# Altium schematic sheet PCI short card universal - 32 BIT-6.schdoc
size A3
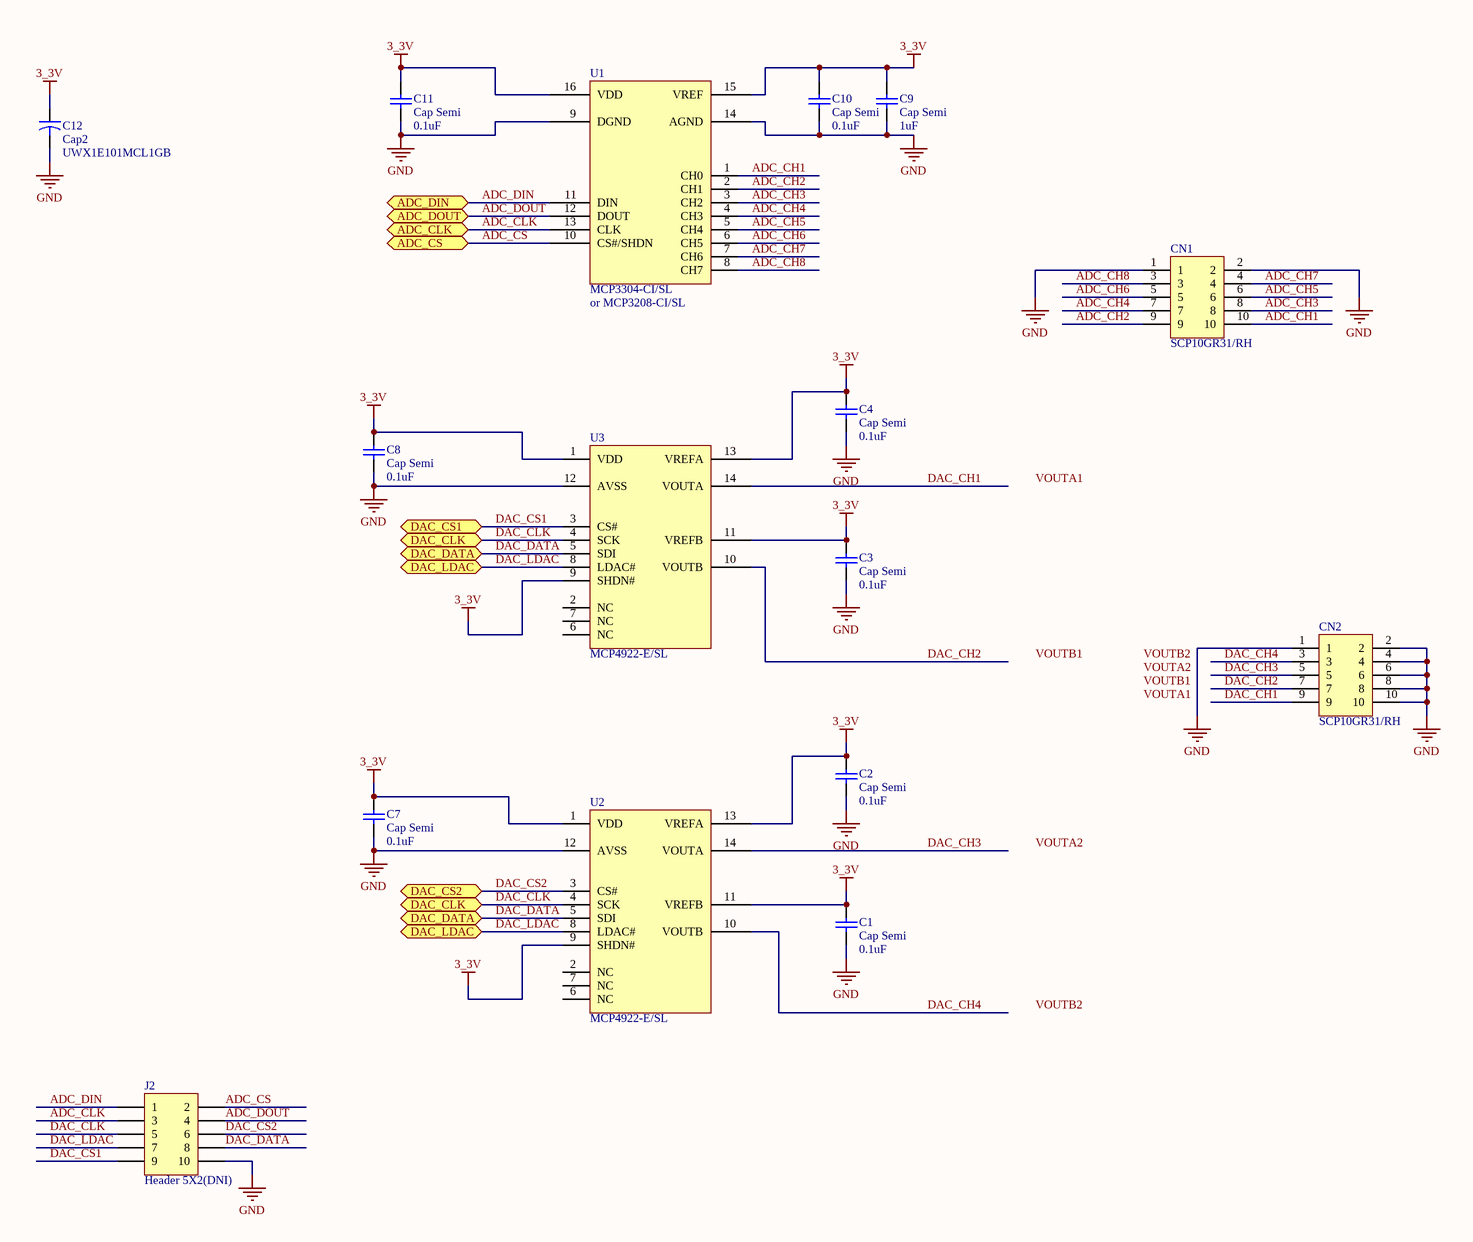
[diagram p0: PCI short card universal - 32 BIT-6.schdoc]

## Parts
C1  Cap Semi  value 0.1uF  [RESC1608N]
C2  Cap Semi  value 0.1uF  [RESC1608N]
C3  Cap Semi  value 0.1uF  [RESC1608N]
C4  Cap Semi  value 0.1uF  [RESC1608N]
C7  Cap Semi  value 0.1uF  [RESC1608N]
C8  Cap Semi  value 0.1uF  [RESC1608N]
C9  Cap Semi  value 1uF  [RESC1608N]
C10  Cap Semi  value 0.1uF  [RESC1608N]
C11  Cap Semi  value 0.1uF  [RESC1608N]
C12  Cap2  value UWX1E101MCL1GB  [ECEL_D8]
CN1  SCP10GR31/RH  [SCP10GR31/RH]
CN2  SCP10GR31/RH  [SCP10GR31/RH]
J2  Header 5X2(DNI)  [HDR2X5]
U1  MCP3304-CI/SL  [MCP3304-CI/SL]
U2  MCP4922-E/SL  [MCP4922-E/SL]
U3  MCP4922-E/SL  [MCP4922-E/SL]

## Ports
ADC_CLK, ADC_CS, ADC_DIN, ADC_DOUT, DAC_CLK, DAC_CS1, DAC_CS2, DAC_DATA, DAC_LDAC

## Nets
3_3V: C1.2 C2.2 C3.2 C4.2 C7.2 C8.2 C9.2 C10.2 C11.2 C12.1 U1.15(VREF) U1.16(VDD) U2.1(VDD) U2.9(SHDN#) U2.11(VREFB) U2.13(VREFA) U3.1(VDD) U3.9(SHDN#) U3.11(VREFB) U3.13(VREFA)
GND: C1.1 C2.1 C3.1 C4.1 C7.1 C8.1 C9.1 C10.1 C11.1 C12.2 CN1.1 CN1.2 CN2.1 CN2.2 CN2.4 CN2.6 CN2.8 CN2.10 J2.10 U1.9(DGND) U1.14(AGND) U2.12(AVSS) U3.12(AVSS)
ADC_CH1: CN1.10 U1.1(CH0)
ADC_CH2: CN1.9 U1.2(CH1)
ADC_CH3: CN1.8 U1.3(CH2)
ADC_CH4: CN1.7 U1.4(CH3)
ADC_CH5: CN1.6 U1.5(CH4)
ADC_CH6: CN1.5 U1.6(CH5)
ADC_CH7: CN1.4 U1.7(CH6)
ADC_CH8: CN1.3 U1.8(CH7)
ADC_CLK: J2.3 U1.13(CLK) ; port ADC_CLK
ADC_CS: J2.2 U1.10(CS#/SHDN) ; port ADC_CS
ADC_DIN: J2.1 U1.11(DIN) ; port ADC_DIN
ADC_DOUT: J2.4 U1.12(DOUT) ; port ADC_DOUT
DAC_CH1: CN2.9 U3.14(VOUTA)
DAC_CH2: CN2.7 U3.10(VOUTB)
DAC_CH3: CN2.5 U2.14(VOUTA)
DAC_CH4: CN2.3 U2.10(VOUTB)
DAC_CLK: J2.5 U2.4(SCK) U3.4(SCK) ; port DAC_CLK
DAC_CS1: J2.9 U3.3(CS#) ; port DAC_CS1
DAC_CS2: J2.6 U2.3(CS#) ; port DAC_CS2
DAC_DATA: J2.8 U2.5(SDI) U3.5(SDI) ; port DAC_DATA
DAC_LDAC: J2.7 U2.8(LDAC#) U3.8(LDAC#) ; port DAC_LDAC

Not connected (* = marked no-connect by the designer): U2 2(NC) 6(NC) 7(NC); U3 2(NC) 6(NC) 7(NC)

## Notes on the sheet
- (near U1) or MCP3208-CI/SL
- Labels drawn without touching a wire or pin: VOUTA1, VOUTA2, VOUTB1, VOUTB2

## Library data of the parts
C1-C4 C7-C11 = Cap Semi: Capacitor (Semiconductor SIM Model); Published: 8-Jun-2000; LatestRevisionDate: 17-Jul-2002; LatestRevisionNote: Re-released for DXP Platform.; PackageReference: C1206; Publisher: Altium Limited
C12 = Cap2: NICHICON; Published: 23-Sep-2002; PackageReference: CAPR5-4X5; Publisher: Altium Limited
CN1 CN2 = SCP10GR31/RH: GTK
J2 = Header 5X2: Header, 5-Pin, Dual row; LatestRevisionDate: 17-Jul-2002; LatestRevisionNote: Re-released for DXP Platform.; Publisher: Altium Limited
U1 = MCP3304-CI/SL: MICROCHIPS
U2 U3 = MCP4922-E/SL: MICROCHIPS